# Altium schematic sheet S7CAS-PLEIADES-CARTE-FILLE_P02_ADC.SchDoc
size Tabloid; DocumentNumber: 4; SheetNumber: 4; SheetTotal: 5; Sheet_Name: ADC; Size: 11x17
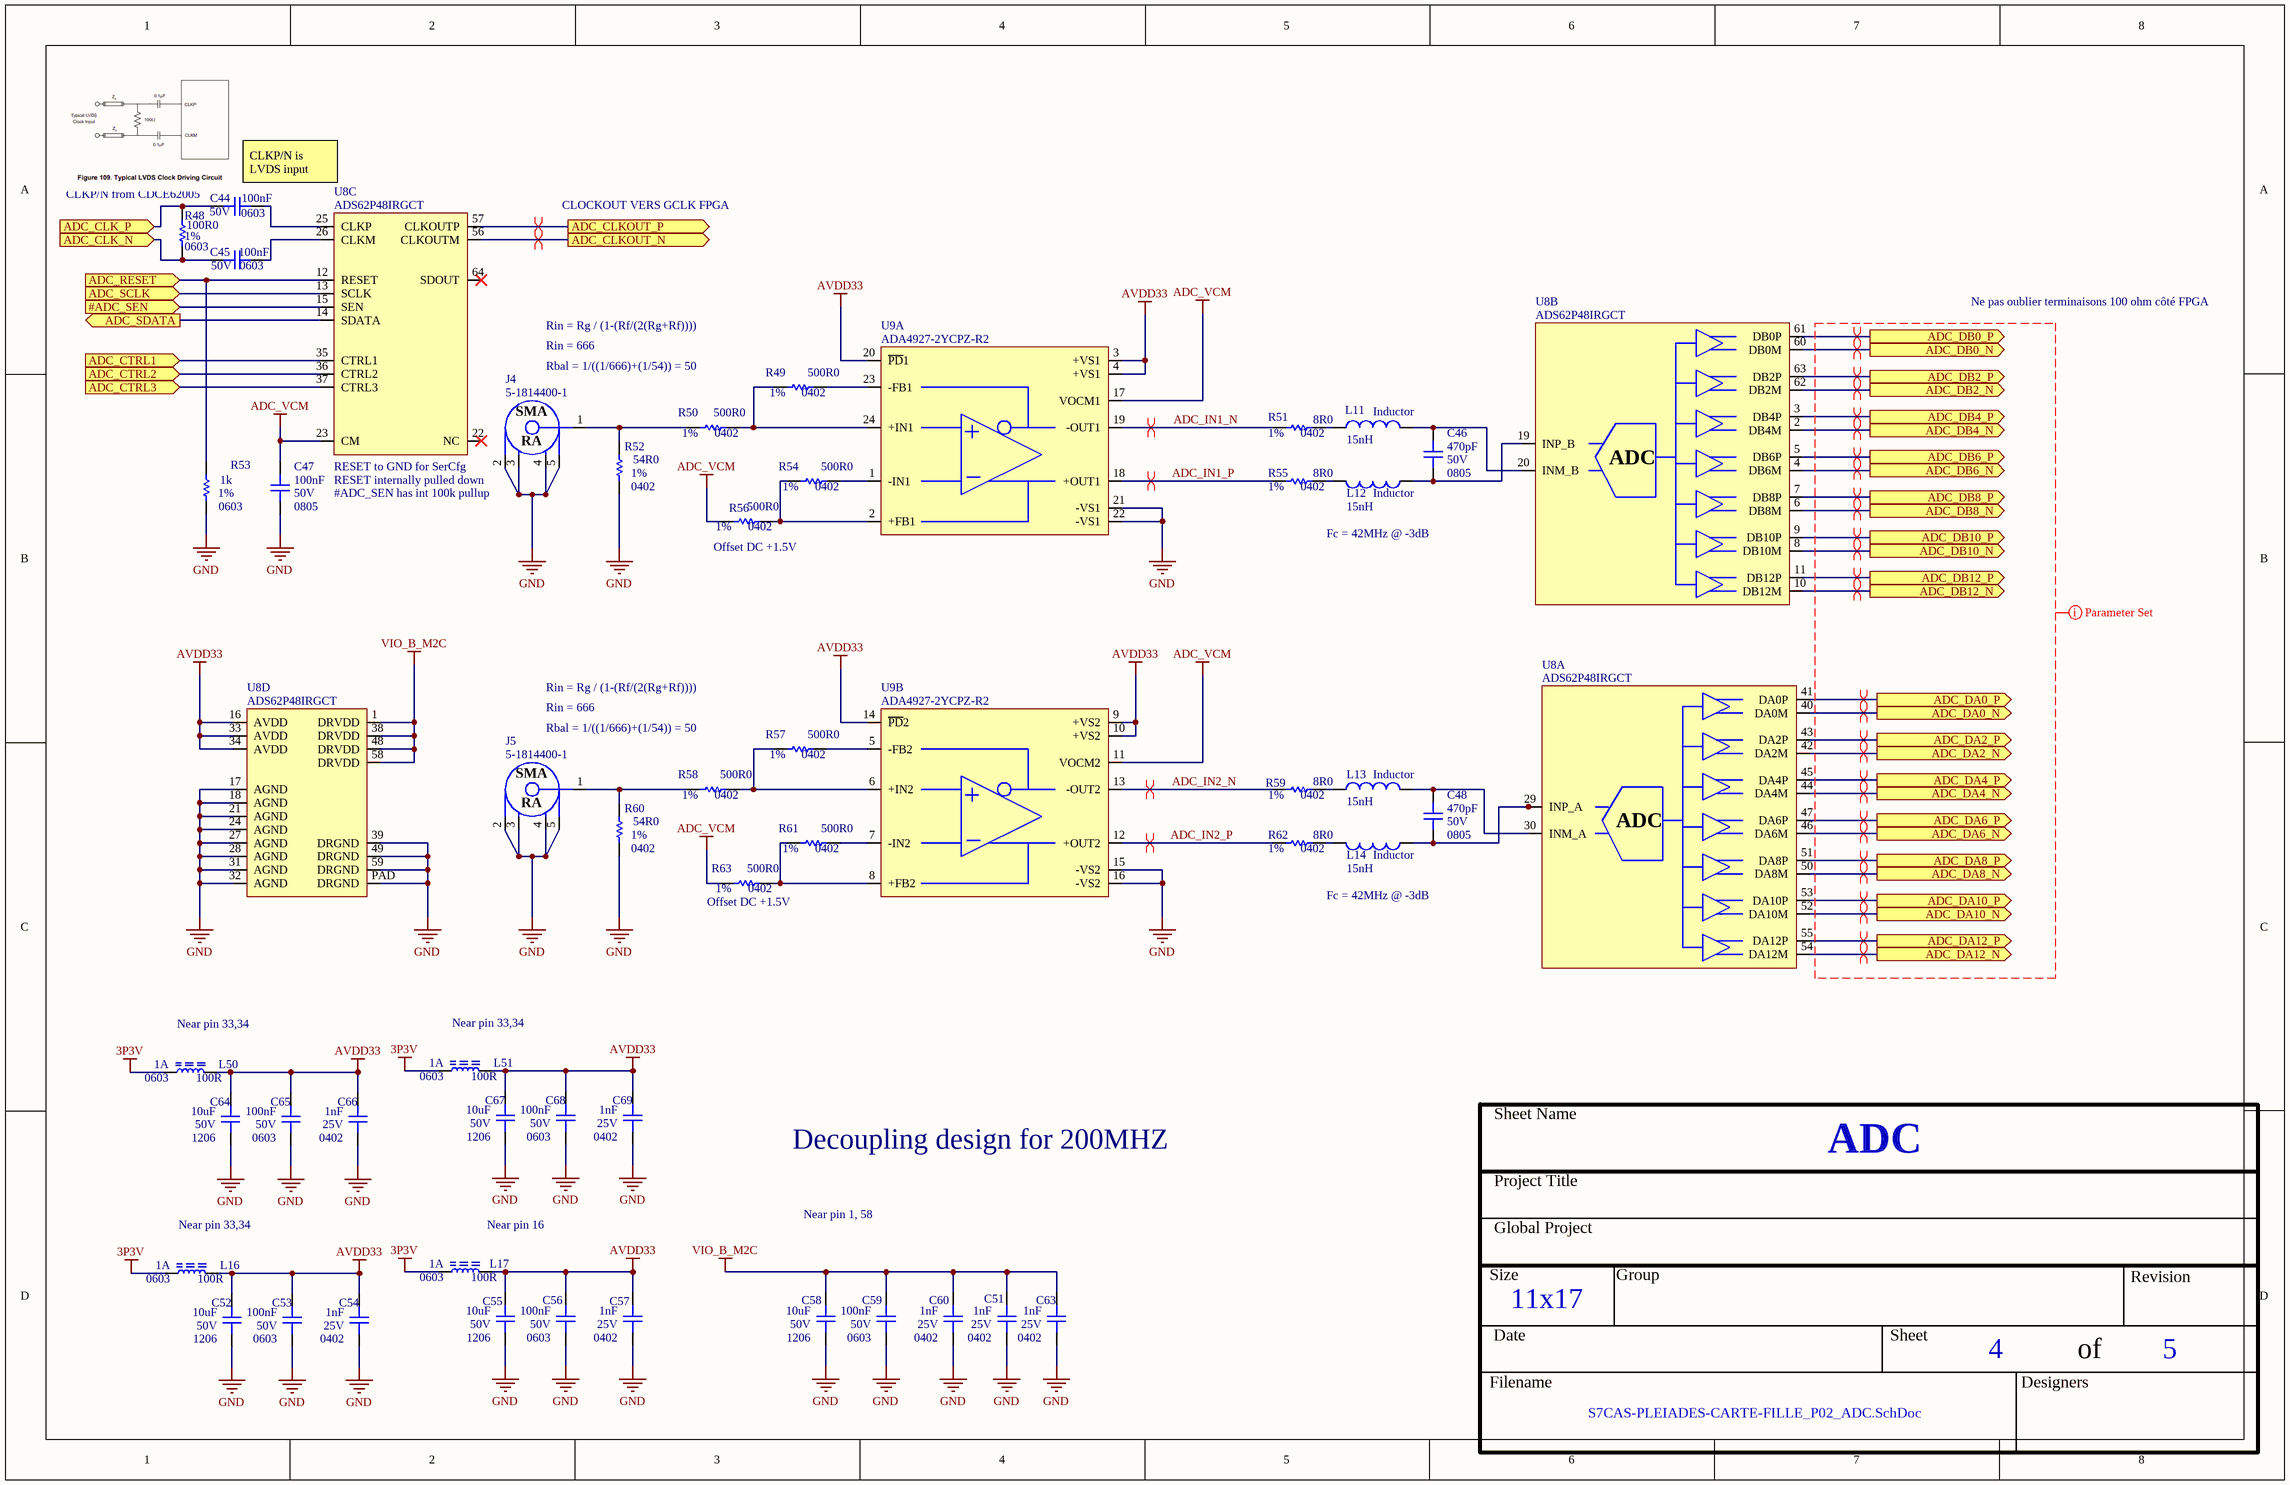
[diagram p0: S7CAS-PLEIADES-CARTE-FILLE_P02_ADC.SchDoc]

## Parts
C44  value 100nF  Voltage: 50V  Package: 0603  [CAP_0603]  (hidden comment: CAP - 0603)
C45  value 100nF  Voltage: 50V  Package: 0603  [CAP_0603]  (hidden comment: CAP - 0603)
C46  value 470pF  Voltage: 50V  Package: 0805  [CAP_0805]  (hidden comment: CAP - 0805)
C47  value 100nF  Voltage: 50V  Package: 0805  [CAP_0805]  (hidden comment: CAP - 0805)
C48  value 470pF  Voltage: 50V  Package: 0805  [CAP_0805]  (hidden comment: CAP - 0805)
C51  value 1nF  Voltage: 25V  Package: 0402  [CAP_0402]  (hidden comment: CAP - 0402)
C52  value 10uF  Voltage: 50V  Package: 1206  [CAP_1206]  (hidden comment: CAP - 1206)
C53  value 100nF  Voltage: 50V  Package: 0603  [CAP_0603]  (hidden comment: CAP - 0603)
C54  value 1nF  Voltage: 25V  Package: 0402  [CAP_0402]  (hidden comment: CAP - 0402)
C55  value 10uF  Voltage: 50V  Package: 1206  [CAP_1206]  (hidden comment: CAP - 1206)
C56  value 100nF  Voltage: 50V  Package: 0603  [CAP_0603]  (hidden comment: CAP - 0603)
C57  value 1nF  Voltage: 25V  Package: 0402  [CAP_0402]  (hidden comment: CAP - 0402)
C58  value 10uF  Voltage: 50V  Package: 1206  [CAP_1206]  (hidden comment: CAP - 1206)
C59  value 100nF  Voltage: 50V  Package: 0603  [CAP_0603]  (hidden comment: CAP - 0603)
C60  value 1nF  Voltage: 25V  Package: 0402  [CAP_0402]  (hidden comment: CAP - 0402)
C63  value 1nF  Voltage: 25V  Package: 0402  [CAP_0402]  (hidden comment: CAP - 0402)
C64  value 10uF  Voltage: 50V  Package: 1206  [CAP_1206]  (hidden comment: CAP - 1206)
C65  value 100nF  Voltage: 50V  Package: 0603  [CAP_0603]  (hidden comment: CAP - 0603)
C66  value 1nF  Voltage: 25V  Package: 0402  [CAP_0402]  (hidden comment: CAP - 0402)
C67  value 10uF  Voltage: 50V  Package: 1206  [CAP_1206]  (hidden comment: CAP - 1206)
C68  value 100nF  Voltage: 50V  Package: 0603  [CAP_0603]  (hidden comment: CAP - 0603)
C69  value 1nF  Voltage: 25V  Package: 0402  [CAP_0402]  (hidden comment: CAP - 0402)
J4  5-1814400-1  [CONN_SMA_5-1814400-1]
J5  5-1814400-1  [CONN_SMA_5-1814400-1]
L11  Inductor  value 15nH  [0402-A]
L12  Inductor  value 15nH  [0402-A]
L13  Inductor  value 15nH  [0402-A]
L14  Inductor  value 15nH  [0402-A]
L16  value 100R  Current: 1A  Package: 0603  [FER_0603]  (hidden comment: FER - 0603)
L17  value 100R  Current: 1A  Package: 0603  [FER_0603]  (hidden comment: FER - 0603)
L50  value 100R  Current: 1A  Package: 0603  [FER_0603]  (hidden comment: FER - 0603)
L51  value 100R  Current: 1A  Package: 0603  [FER_0603]  (hidden comment: FER - 0603)
R48  value 100R0  Package: 0603  Precision: 1%  [RES_0603]  (hidden comment: RES - 0603)
R49  value 500R0  Package: 0402  Precision: 1%  [RES_0402]  (hidden comment: RES - 0402)
R50  value 500R0  Package: 0402  Precision: 1%  [RES_0402]  (hidden comment: RES - 0402)
R51  value 8R0  Package: 0402  Precision: 1%  [RES_0402]  (hidden comment: RES - 0402)
R52  value 54R0  Package: 0402  Precision: 1%  [RES_0402]  (hidden comment: RES - 0402)
R53  value 1k  Package: 0603  Precision: 1%  [RES_0603]  (hidden comment: RES - 0603)
R54  value 500R0  Package: 0402  Precision: 1%  [RES_0402]  (hidden comment: RES - 0402)
R55  value 8R0  Package: 0402  Precision: 1%  [RES_0402]  (hidden comment: RES - 0402)
R56  value 500R0  Package: 0402  Precision: 1%  [RES_0402]  (hidden comment: RES - 0402)
R57  value 500R0  Package: 0402  Precision: 1%  [RES_0402]  (hidden comment: RES - 0402)
R58  value 500R0  Package: 0402  Precision: 1%  [RES_0402]  (hidden comment: RES - 0402)
R59  value 8R0  Package: 0402  Precision: 1%  [RES_0402]  (hidden comment: RES - 0402)
R60  value 54R0  Package: 0402  Precision: 1%  [RES_0402]  (hidden comment: RES - 0402)
R61  value 500R0  Package: 0402  Precision: 1%  [RES_0402]  (hidden comment: RES - 0402)
R62  value 8R0  Package: 0402  Precision: 1%  [RES_0402]  (hidden comment: RES - 0402)
R63  value 500R0  Package: 0402  Precision: 1%  [RES_0402]  (hidden comment: RES - 0402)
U8  ADS62P48IRGCT  [ADC_ADS62P48IRGCT]  (parts A,B,C,D of 4)
U9  ADA4927-2YCPZ-R2  [OPAMP_ADA4927-2YCPZ-R2]  (parts A,B of 2)

## Ports
#ADC_SEN (in), ADC_CLK_N (in), ADC_CLK_P (in), ADC_CLKOUT_N (out), ADC_CLKOUT_P (out), ADC_CTRL1 (in), ADC_CTRL2 (in), ADC_CTRL3 (in), ADC_DA0_N (out), ADC_DA0_P (out), ADC_DA2_N (out), ADC_DA2_P (out), ADC_DA4_N (out), ADC_DA4_P (out), ADC_DA6_N (out), ADC_DA6_P (out), ADC_DA8_N (out), ADC_DA8_P (out), ADC_DA10_N (out), ADC_DA10_P (out), ADC_DA12_N (out), ADC_DA12_P (out), ADC_DB0_N (out), ADC_DB0_P (out), ADC_DB2_N (out), ADC_DB2_P (out), ADC_DB4_N (out), ADC_DB4_P (out), ADC_DB6_N (out), ADC_DB6_P (out), ADC_DB8_N (out), ADC_DB8_P (out), ADC_DB10_N (out), ADC_DB10_P (out), ADC_DB12_N (out), ADC_DB12_P (out), ADC_RESET (in), ADC_SCLK (in), ADC_SDATA (out)

## Nets
3P3V: L16.1 L17.1 L50.1 L51.1
ADC_VCM: C47.2 R56.2 R63.2 U8.23(CM) U9.11(VOCM2) U9.17(VOCM1)
AVDD33: C52.2 C53.2 C54.2 C55.2 C56.2 C57.2 C64.2 C65.2 C66.2 C67.2 C68.2 C69.2 L16.2 L17.2 L50.2 L51.2 U8.16(AVDD) U8.33(AVDD) U8.34(AVDD) U9.3(+VS1) U9.4(+VS1) U9.9(+VS2) U9.10(+VS2) U9.14(~{PD}2) U9.20(~{PD}1)
GND: C47.1 C51.1 C52.1 C53.1 C54.1 C55.1 C56.1 C57.1 C58.1 C59.1 C60.1 C63.1 C64.1 C65.1 C66.1 C67.1 C68.1 C69.1 J4.2 J4.3 J4.4 J4.5 J5.2 J5.3 J5.4 J5.5 R52.1 R53.1 R60.1 U8.17(AGND) U8.18(AGND) U8.21(AGND) U8.24(AGND) U8.27(AGND) U8.28(AGND) U8.31(AGND) U8.32(AGND) U8.39(DRGND) U8.49(DRGND) U8.59(DRGND) U8.PAD(DRGND) U9.15(-VS2) U9.16(-VS2) U9.21(-VS1) U9.22(-VS1)
VIO_B_M2C: C51.2 C58.2 C59.2 C60.2 C63.2 U8.1(DRVDD) U8.38(DRVDD) U8.48(DRVDD) U8.58(DRVDD)
#ADC_SEN: U8.15(SEN) ; port #ADC_SEN
ADC_CLK_N: C45.2 R48.1 ; port ADC_CLK_N
ADC_CLK_P: C44.2 R48.2 ; port ADC_CLK_P
ADC_CLKOUT_N: U8.56(CLKOUTM) ; port ADC_CLKOUT_N
ADC_CLKOUT_P: U8.57(CLKOUTP) ; port ADC_CLKOUT_P
ADC_CTRL1: U8.35(CTRL1) ; port ADC_CTRL1
ADC_CTRL2: U8.36(CTRL2) ; port ADC_CTRL2
ADC_CTRL3: U8.37(CTRL3) ; port ADC_CTRL3
ADC_DA0_N: U8.40(DA0M) ; port ADC_DA0_N
ADC_DA0_P: U8.41(DA0P) ; port ADC_DA0_P
ADC_DA2_N: U8.42(DA2M) ; port ADC_DA2_N
ADC_DA2_P: U8.43(DA2P) ; port ADC_DA2_P
ADC_DA4_N: U8.44(DA4M) ; port ADC_DA4_N
ADC_DA4_P: U8.45(DA4P) ; port ADC_DA4_P
ADC_DA6_N: U8.46(DA6M) ; port ADC_DA6_N
ADC_DA6_P: U8.47(DA6P) ; port ADC_DA6_P
ADC_DA8_N: U8.50(DA8M) ; port ADC_DA8_N
ADC_DA8_P: U8.51(DA8P) ; port ADC_DA8_P
ADC_DA10_N: U8.52(DA10M) ; port ADC_DA10_N
ADC_DA10_P: U8.53(DA10P) ; port ADC_DA10_P
ADC_DA12_N: U8.54(DA12M) ; port ADC_DA12_N
ADC_DA12_P: U8.55(DA12P) ; port ADC_DA12_P
ADC_DB0_N: U8.60(DB0M) ; port ADC_DB0_N
ADC_DB0_P: U8.61(DB0P) ; port ADC_DB0_P
ADC_DB2_N: U8.62(DB2M) ; port ADC_DB2_N
ADC_DB2_P: U8.63(DB2P) ; port ADC_DB2_P
ADC_DB4_N: U8.2(DB4M) ; port ADC_DB4_N
ADC_DB4_P: U8.3(DB4P) ; port ADC_DB4_P
ADC_DB6_N: U8.4(DB6M) ; port ADC_DB6_N
ADC_DB6_P: U8.5(DB6P) ; port ADC_DB6_P
ADC_DB8_N: U8.6(DB8M) ; port ADC_DB8_N
ADC_DB8_P: U8.7(DB8P) ; port ADC_DB8_P
ADC_DB10_N: U8.8(DB10M) ; port ADC_DB10_N
ADC_DB10_P: U8.9(DB10P) ; port ADC_DB10_P
ADC_DB12_N: U8.10(DB12M) ; port ADC_DB12_N
ADC_DB12_P: U8.11(DB12P) ; port ADC_DB12_P
ADC_IN1_N: R51.2 U9.19(-OUT1)
ADC_IN1_P: R55.2 U9.18(+OUT1)
ADC_IN2_N: R59.2 U9.13(-OUT2)
ADC_IN2_P: R62.2 U9.12(+OUT2)
ADC_RESET: R53.2 U8.12(RESET) ; port ADC_RESET
ADC_SCLK: U8.13(SCLK) ; port ADC_SCLK
ADC_SDATA: U8.14(SDATA) ; port ADC_SDATA
NetC44_1: C44.1 U8.25(CLKP)
NetC45_1: C45.1 U8.26(CLKM)
NetC46_1: C46.1 L12.1 U8.19(INP_B)
NetC46_2: C46.2 L11.2 U8.20(INM_B)
NetC48_1: C48.1 L14.1 U8.29(INP_A)
NetC48_2: C48.2 L13.2 U8.30(INM_A)
NetJ4_1: J4.1 R50.2 R52.2
NetJ5_1: J5.1 R58.2 R60.2
NetL11_1: L11.1 R51.1
NetL12_2: L12.2 R55.1
NetL13_1: L13.1 R59.1
NetL14_2: L14.2 R62.1
NetR49_1: R49.1 U9.23(-FB1)
NetR49_2: R49.2 R50.1 U9.24(+IN1)
NetR54_1: R54.1 U9.1(-IN1)
NetR54_2: R54.2 R56.1 U9.2(+FB1)
NetR57_1: R57.1 U9.5(-FB2)
NetR57_2: R57.2 R58.1 U9.6(+IN2)
NetR61_1: R61.1 U9.7(-IN2)
NetR61_2: R61.2 R63.1 U9.8(+FB2)

Not connected (* = marked no-connect by the designer): U8 22(NC)* 64(SDOUT)*

## Layout directives
differential pair; differential pair class ADC_DIF: ADC_CLKOUT_N, ADC_CLKOUT_P, ADC_DA0_N, ADC_DA0_P, ADC_DA2_N, ADC_DA2_P, ADC_DA4_N, ADC_DA4_P, ADC_DA6_N, ADC_DA6_P, ADC_DA8_N, ADC_DA8_P, ADC_DA10_N, ADC_DA10_P, ADC_DA12_N, ADC_DA12_P, ADC_DB0_N, ADC_DB0_P, ADC_DB2_N, ADC_DB2_P, ADC_DB4_N, ADC_DB4_P, ADC_DB6_N, ADC_DB6_P, ADC_DB8_N, ADC_DB8_P, ADC_DB10_N, ADC_DB10_P, ADC_DB12_N, ADC_DB12_P, ADC_IN1_N, ADC_IN1_P, ADC_IN2_N, ADC_IN2_P
rule Differential Pairs Routing [Pref Gap = 10mil    Min Gap  = 10mil    Max Gap  = 10milPref Width = 15mil    Min Width  = 15mil    Max Width  = 15mil]: (no net found under the mark)

## Notes on the sheet
- (near R48) CLKP/N from CDCE62005
- (near C44) CLKP/N is LVDS input
- CLOCKOUT VERS GCLK FPGA
- Rin = Rg / (1-(Rf/(2(Rg+Rf))))
- Rin = 666
- (near U8) Ne pas oublier terminaisons 100 ohm côté FPGA
- Rbal = 1/((1/666)+(1/54)) = 50
- RESET to GND for SerCfg
- RESET internally pulled down
- #ADC_SEN has int 100k pullup
- (near R56) Offset DC +1.5V
- Fc = 42MHz @ -3dB
- (near R63) Offset DC +1.5V
- (near L50) Near pin 33,34
- (near L51) Near pin 33,34
- Decoupling design for 200MHZ
- (near L16) Near pin 33,34
- (near L17) Near pin 16
- Near pin 1, 58
- Sheet Name
- Project Title
- Global Project
- Size
- Group
- Revision
- Date
- Sheet
- of
- Filename
- Designers
- (in symbol ADC_ADS62P48IRGCT, part A) ADC
- (in symbol ADC_ADS62P48IRGCT, part B) ADC
- (in symbol CONN_SMA_5-1814400-1) SMA; RA

## Library data of the parts
C44 C45 C53 C56 C59 C65 C68 = CAP - 0603: Precision: 10%; Current: *; CreatedBy: Jonathan Bouchard; Power: *
C46-C48 = CAP - 0805: Precision: 10%; Current: *; CreatedBy: Jonathan Bouchard; Power: *
C51 C54 C57 C60 C63 C66 C69 = CAP - 0402: Precision: 10%; Current: *; CreatedBy: Jonathan Bouchard; Power: *
C52 C55 C58 C64 C67 = CAP - 1206: Precision: 10%; Current: *; CreatedBy: Jonathan Bouchard; Power: *
J4 J5 = CONN_SMA_5-1814400-1: CONN -  SMA JACK R/A 50 OHM - TH; Mfg: TE Connectivity AMP Connectors; Voltage: *; Current: *; Power: *; Mfg Part Number: 5-1814400-1; HelpURL: http://www.te.com/commerce/DocumentDelivery/DDEController?Action=srchrtrv&DocNm=1814400&DocType=Customer+Drawing&DocLang=English; CreatedBy: Jonathan Bouchard; Temperature: -55°C ~ 85°C; Value: *; Precision: *; Package: TH-5; Supplier 1: Digikey; Supplier Part Number 1: A97593-ND
L11-L14 = Inductor: Code_IEC: 1005; Published: 8-Jun-2000; LatestRevisionDate: 29-May-2009; LatestRevisionNote: IPC-7351 Footprint Added.; PackageReference: 0402-A; Publisher: Altium Limited; PackageDescription: Chip Inductor; Code_JEITA: 0402
R49-R52 R54-R63 = RES - 0402: Voltage: 50V; Power: 1/16W; Current: *; CreatedBy: Jonathan Bouchard
U8 = ADC_ADS62P48IRGCT: ADC - 14 BIT 210MSPS SUAL - VQFN-64; Voltage: 3.15 V ~ 3.6 V / 1.7 V ~ 1.9 V; Mfg: Texas Instruments; Precision: 14 Bit; Current: *; Power: *; Mfg Part Number: ADS62P48IRGCT; HelpURL: http://www.ti.com/lit/ds/symlink/ads62p48.pdf; CreatedBy: Jonathan Bouchard; Temperature: -40°C ~ 85°C; Value: *; Package: VQFN-64; Supplier 1: Digikey; Supplier Part Number 1: 296-24611-1-ND
U9 = OPAMP_ADA4927-2YCPZ-R2: OPAMP - CFA 2.3GHZ - QFN-24; Voltage: 4.5 V ~ 11 V, ±2.25 V ~ 5.5 V; Current: 65mA; Mfg: Analog Devices; Power: *; Mfg Part Number: ADA4927-2YCPZ-R2; HelpURL: http://www.analog.com/media/en/technical-documentation/data-sheets/ADA4927-1_4927-2.pdf; CreatedBy: Jonathan Bouchard; Temperature: -40°C ~ 105°C; Value: *; Precision: *; Package: QFN-24; Supplier 1: Digikey; Supplier Part Number 1: ADA4927-2YCPZ-R2CT-ND
L16 L17 L50 L51 = FER - 0603: Voltage: *; CreatedBy: Jonathan Bouchard; Power: *; Precision: *
R48 R53 = RES - 0603: Current: *; CreatedBy: Jonathan Bouchard